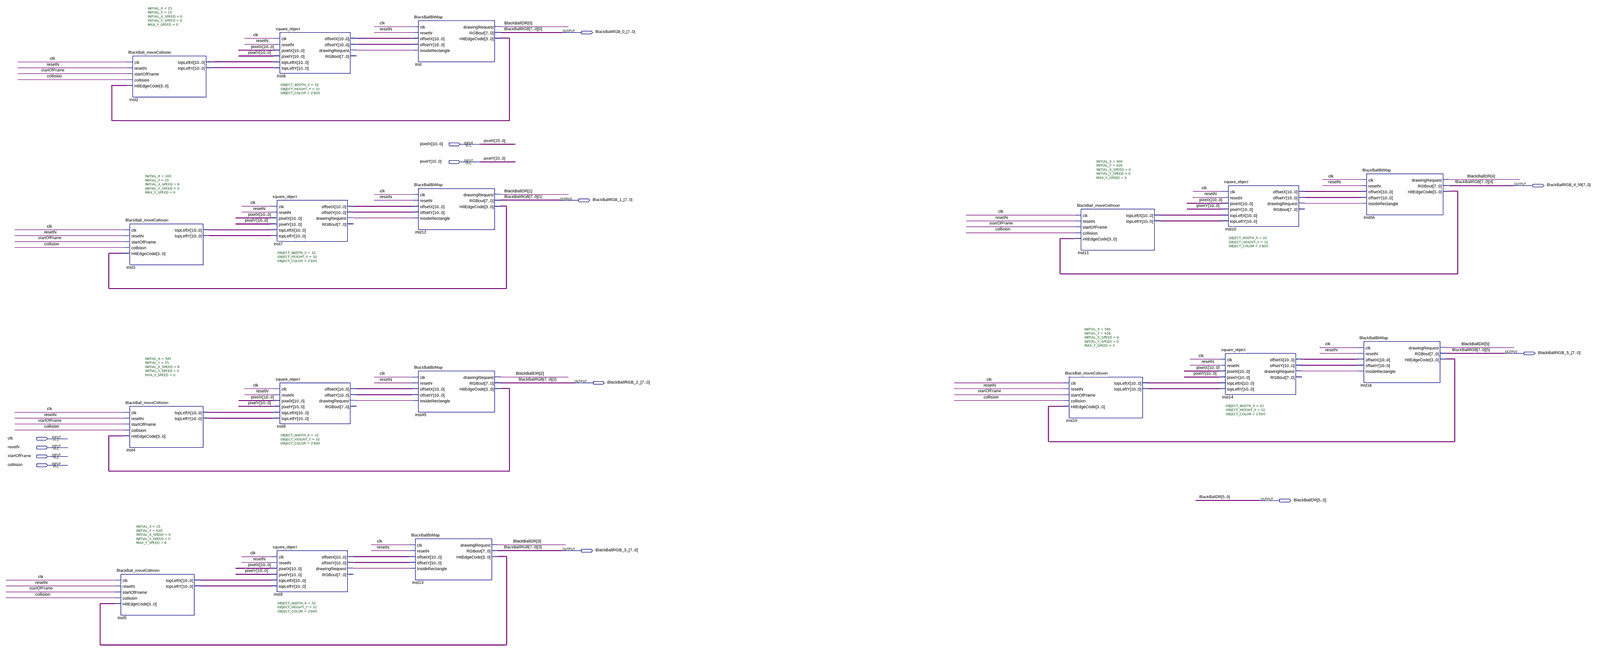
[diagram p0: schematic sheet, whole]
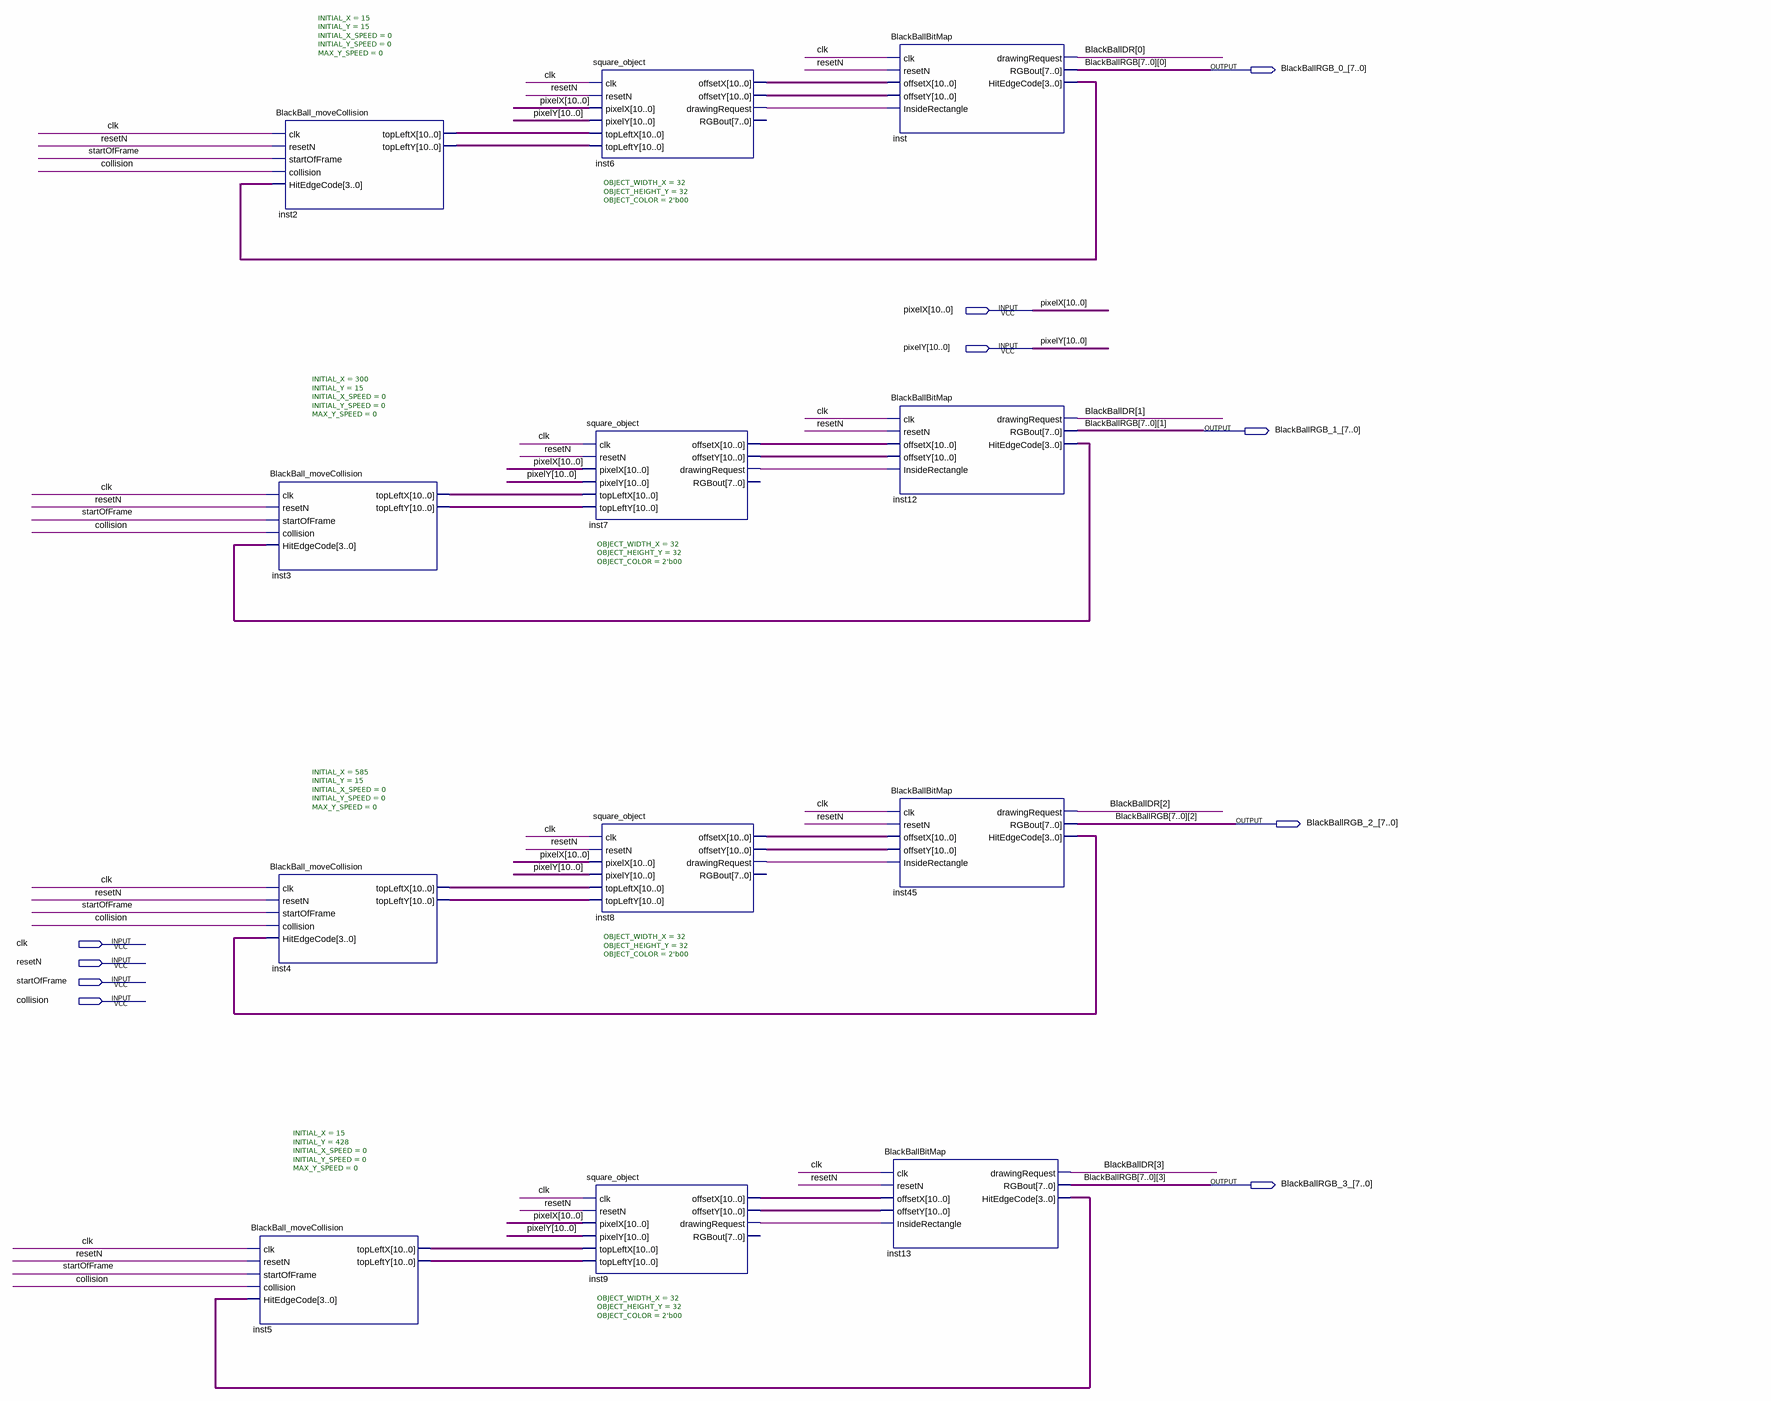
[diagram p1: schematic sheet, left part]
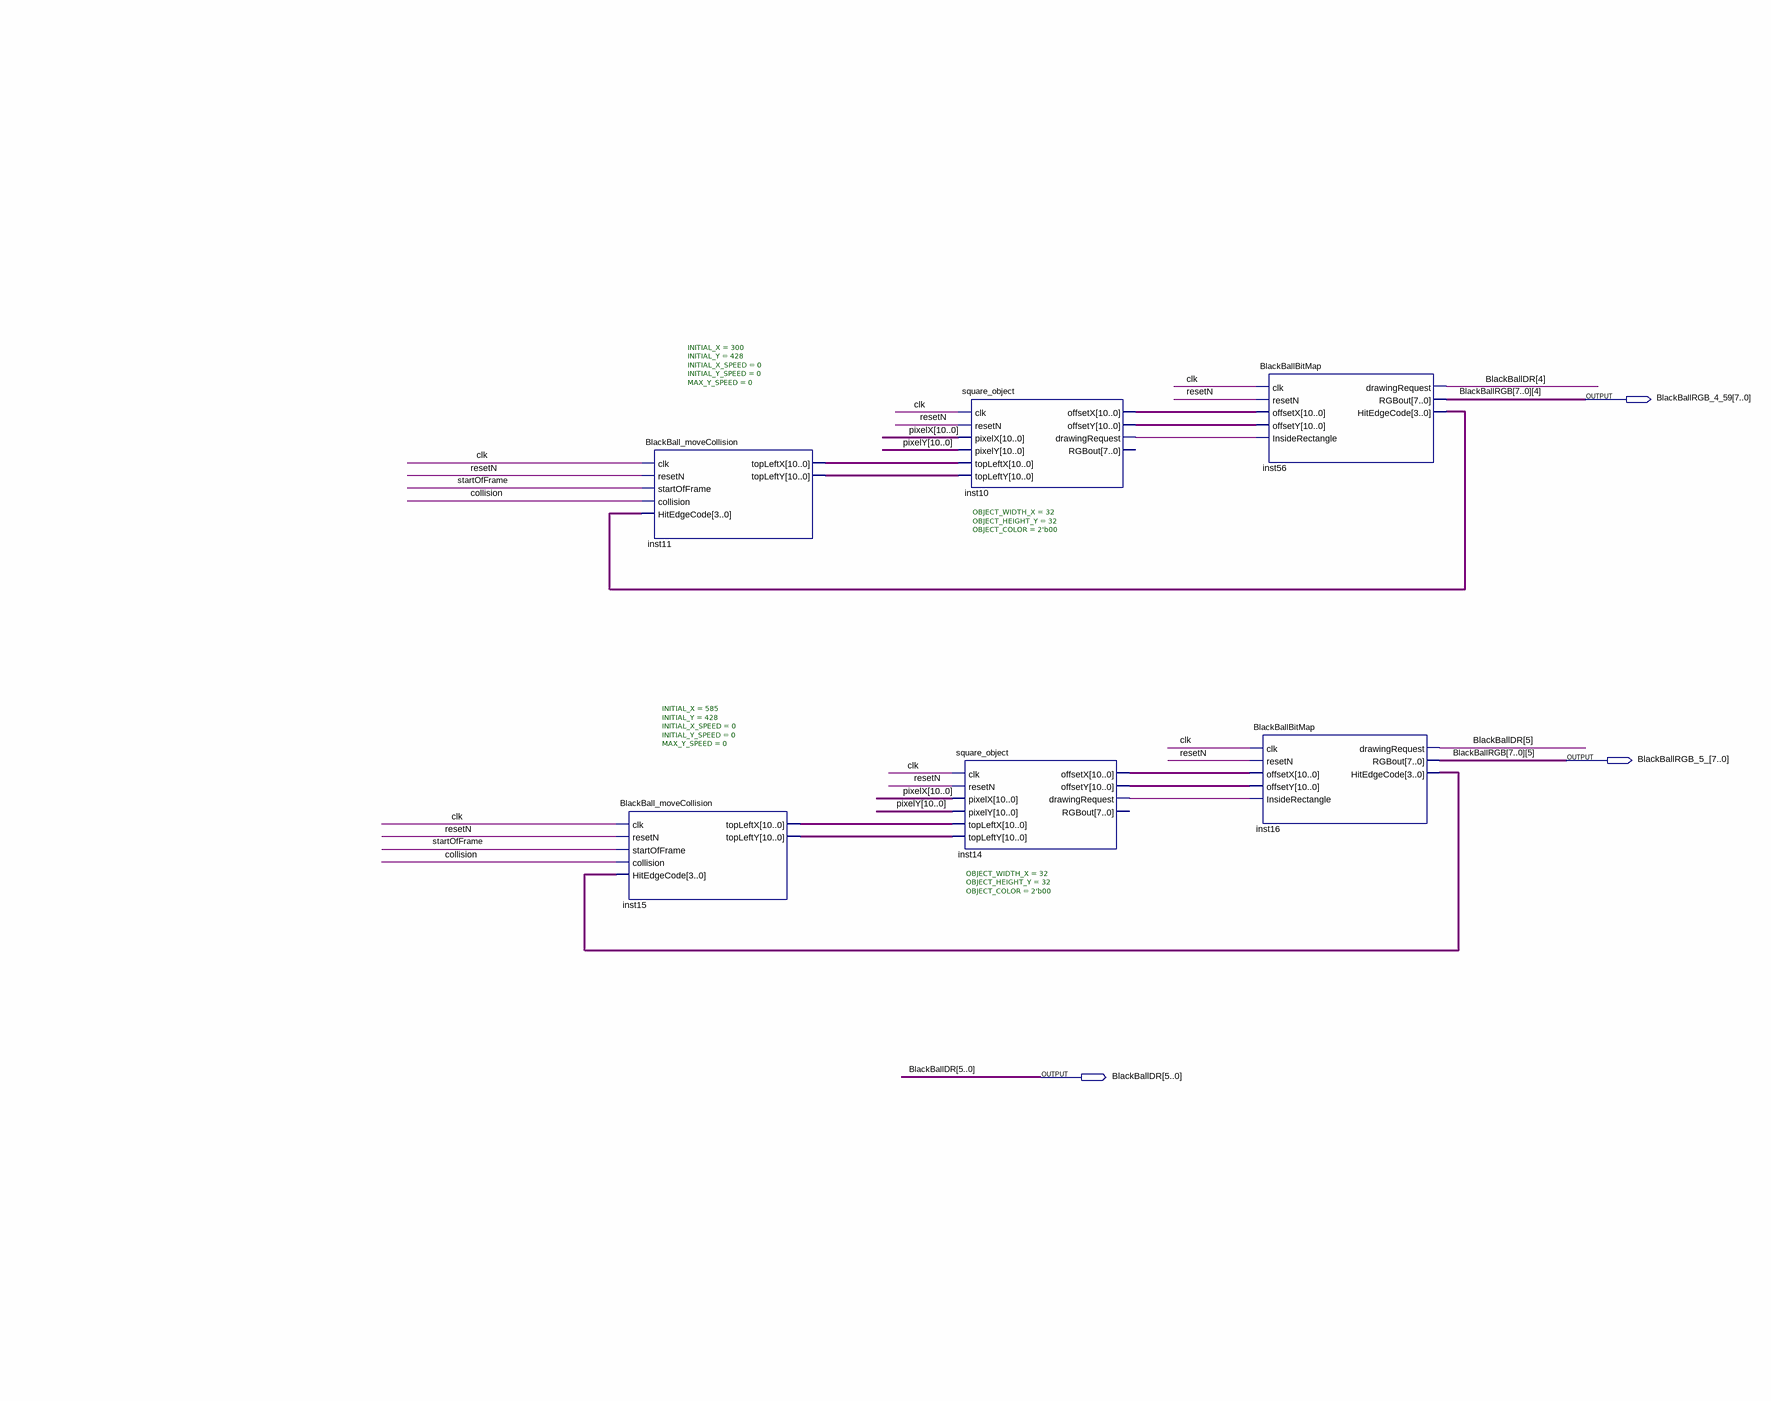
[diagram p2: schematic sheet, right part]
// Quartus schematic BlackBall_Block.bdf as structural Verilog: 18 symbols, 13 pins
module BlackBall_Block (
  input  [10:0] pixelX,
  input  [10:0] pixelY,
  input  clk,
  input  resetN,
  input  startOfFrame,
  input  collision,
  output [7:0] BlackBallRGB_0_,
  output [7:0] BlackBallRGB_4_59,
  output [7:0] BlackBallRGB_1_,
  output [7:0] BlackBallRGB_5_,
  output [7:0] BlackBallRGB_2_,
  output [5:0] BlackBallDR,
  output [7:0] BlackBallRGB_3_
);

  wire inst6_drawingrequest, inst7_drawingrequest, inst8_drawingrequest, inst9_drawingrequest,
       inst10_drawingrequest, inst14_drawingrequest;
  wire [3:0] inst12_hitedgecode, inst13_hitedgecode, inst16_hitedgecode, inst45_hitedgecode,
       inst56_hitedgecode, inst_hitedgecode;
  wire [10:0] inst2_topleftx, inst2_toplefty, inst3_topleftx, inst3_toplefty, inst4_topleftx, inst4_toplefty,
       inst5_topleftx, inst5_toplefty, inst6_offsetx, inst6_offsety, inst7_offsetx, inst7_offsety,
       inst8_offsetx, inst8_offsety, inst9_offsetx, inst9_offsety, inst10_offsetx, inst10_offsety,
       inst11_topleftx, inst11_toplefty, inst14_offsetx, inst14_offsety, inst15_topleftx, inst15_toplefty;

  BlackBall_moveCollision #(.INITIAL_X(15), .INITIAL_Y(15), .INITIAL_X_SPEED(0), .INITIAL_Y_SPEED(0), .MAX_Y_SPEED(0)) inst2 (
    .clk(clk), .resetN(resetN), .startOfFrame(startOfFrame), .collision(collision),
    .HitEdgeCode(inst_hitedgecode), .topLeftX(inst2_topleftx), .topLeftY(inst2_toplefty));
  BlackBall_moveCollision #(.INITIAL_X(300), .INITIAL_Y(15), .INITIAL_X_SPEED(0), .INITIAL_Y_SPEED(0), .MAX_Y_SPEED(0)) inst3 (
    .clk(clk), .resetN(resetN), .startOfFrame(startOfFrame), .collision(collision),
    .HitEdgeCode(inst12_hitedgecode), .topLeftX(inst3_topleftx), .topLeftY(inst3_toplefty));
  BlackBall_moveCollision #(.INITIAL_X(585), .INITIAL_Y(15), .INITIAL_X_SPEED(0), .INITIAL_Y_SPEED(0), .MAX_Y_SPEED(0)) inst4 (
    .clk(clk), .resetN(resetN), .startOfFrame(startOfFrame), .collision(collision),
    .HitEdgeCode(inst45_hitedgecode), .topLeftX(inst4_topleftx), .topLeftY(inst4_toplefty));
  BlackBall_moveCollision #(.INITIAL_X(15), .INITIAL_Y(428), .INITIAL_X_SPEED(0), .INITIAL_Y_SPEED(0), .MAX_Y_SPEED(0)) inst5 (
    .clk(clk), .resetN(resetN), .startOfFrame(startOfFrame), .collision(collision),
    .HitEdgeCode(inst13_hitedgecode), .topLeftX(inst5_topleftx), .topLeftY(inst5_toplefty));
  square_object #(.OBJECT_WIDTH_X(32), .OBJECT_HEIGHT_Y(32), .OBJECT_COLOR(2'b00)) inst6 (
    .clk(clk), .resetN(resetN), .pixelX(pixelX), .pixelY(pixelY), .topLeftX(inst2_topleftx),
    .topLeftY(inst2_toplefty), .offsetX(inst6_offsetx), .offsetY(inst6_offsety),
    .drawingRequest(inst6_drawingrequest));  // open: RGBout
  square_object #(.OBJECT_WIDTH_X(32), .OBJECT_HEIGHT_Y(32), .OBJECT_COLOR(2'b00)) inst7 (
    .clk(clk), .resetN(resetN), .pixelX(pixelX), .pixelY(pixelY), .topLeftX(inst3_topleftx),
    .topLeftY(inst3_toplefty), .offsetX(inst7_offsetx), .offsetY(inst7_offsety),
    .drawingRequest(inst7_drawingrequest));  // open: RGBout
  square_object #(.OBJECT_WIDTH_X(32), .OBJECT_HEIGHT_Y(32), .OBJECT_COLOR(2'b00)) inst8 (
    .clk(clk), .resetN(resetN), .pixelX(pixelX), .pixelY(pixelY), .topLeftX(inst4_topleftx),
    .topLeftY(inst4_toplefty), .offsetX(inst8_offsetx), .offsetY(inst8_offsety),
    .drawingRequest(inst8_drawingrequest));  // open: RGBout
  square_object #(.OBJECT_WIDTH_X(32), .OBJECT_HEIGHT_Y(32), .OBJECT_COLOR(2'b00)) inst9 (
    .clk(clk), .resetN(resetN), .pixelX(pixelX), .pixelY(pixelY), .topLeftX(inst5_topleftx),
    .topLeftY(inst5_toplefty), .offsetX(inst9_offsetx), .offsetY(inst9_offsety),
    .drawingRequest(inst9_drawingrequest));  // open: RGBout
  BlackBallBitMap inst13 (
    .clk(clk), .resetN(resetN), .offsetX(inst9_offsetx), .offsetY(inst9_offsety),
    .InsideRectangle(inst9_drawingrequest), .drawingRequest(BlackBallDR[3]), .RGBout(BlackBallRGB_3_),
    .HitEdgeCode(inst13_hitedgecode));
  BlackBallBitMap inst (
    .clk(clk), .resetN(resetN), .offsetX(inst6_offsetx), .offsetY(inst6_offsety),
    .InsideRectangle(inst6_drawingrequest), .drawingRequest(BlackBallDR[0]), .RGBout(BlackBallRGB_0_),
    .HitEdgeCode(inst_hitedgecode));
  BlackBallBitMap inst12 (
    .clk(clk), .resetN(resetN), .offsetX(inst7_offsetx), .offsetY(inst7_offsety),
    .InsideRectangle(inst7_drawingrequest), .drawingRequest(BlackBallDR[1]), .RGBout(BlackBallRGB_1_),
    .HitEdgeCode(inst12_hitedgecode));
  BlackBallBitMap inst45 (
    .clk(clk), .resetN(resetN), .offsetX(inst8_offsetx), .offsetY(inst8_offsety),
    .InsideRectangle(inst8_drawingrequest), .drawingRequest(BlackBallDR[2]), .RGBout(BlackBallRGB_2_),
    .HitEdgeCode(inst45_hitedgecode));
  BlackBall_moveCollision #(.INITIAL_X(585), .INITIAL_Y(428), .INITIAL_X_SPEED(0), .INITIAL_Y_SPEED(0), .MAX_Y_SPEED(0)) inst15 (
    .clk(clk), .resetN(resetN), .startOfFrame(startOfFrame), .collision(collision),
    .HitEdgeCode(inst16_hitedgecode), .topLeftX(inst15_topleftx), .topLeftY(inst15_toplefty));
  BlackBall_moveCollision #(.INITIAL_X(300), .INITIAL_Y(428), .INITIAL_X_SPEED(0), .INITIAL_Y_SPEED(0), .MAX_Y_SPEED(0)) inst11 (
    .clk(clk), .resetN(resetN), .startOfFrame(startOfFrame), .collision(collision),
    .HitEdgeCode(inst56_hitedgecode), .topLeftX(inst11_topleftx), .topLeftY(inst11_toplefty));
  square_object #(.OBJECT_WIDTH_X(32), .OBJECT_HEIGHT_Y(32), .OBJECT_COLOR(2'b00)) inst10 (
    .clk(clk), .resetN(resetN), .pixelX(pixelX), .pixelY(pixelY), .topLeftX(inst11_topleftx),
    .topLeftY(inst11_toplefty), .offsetX(inst10_offsetx), .offsetY(inst10_offsety),
    .drawingRequest(inst10_drawingrequest));  // open: RGBout
  square_object #(.OBJECT_WIDTH_X(32), .OBJECT_HEIGHT_Y(32), .OBJECT_COLOR(2'b00)) inst14 (
    .clk(clk), .resetN(resetN), .pixelX(pixelX), .pixelY(pixelY), .topLeftX(inst15_topleftx),
    .topLeftY(inst15_toplefty), .offsetX(inst14_offsetx), .offsetY(inst14_offsety),
    .drawingRequest(inst14_drawingrequest));  // open: RGBout
  BlackBallBitMap inst56 (
    .clk(clk), .resetN(resetN), .offsetX(inst10_offsetx), .offsetY(inst10_offsety),
    .InsideRectangle(inst10_drawingrequest), .drawingRequest(BlackBallDR[4]), .RGBout(BlackBallRGB_4_59),
    .HitEdgeCode(inst56_hitedgecode));
  BlackBallBitMap inst16 (
    .clk(clk), .resetN(resetN), .offsetX(inst14_offsetx), .offsetY(inst14_offsety),
    .InsideRectangle(inst14_drawingrequest), .drawingRequest(BlackBallDR[5]), .RGBout(BlackBallRGB_5_),
    .HitEdgeCode(inst16_hitedgecode));

  // Other names for the same wires on the sheet: BlackBallRGB_0[5:0] = {BlackBallRGB_5_[0], BlackBallRGB_4_59[0], BlackBallRGB_3_[0], BlackBallRGB_2_[0], BlackBallRGB_1_[0], BlackBallRGB_0_[0]};
  //   BlackBallRGB_1[5:0] = {BlackBallRGB_5_[1], BlackBallRGB_4_59[1], BlackBallRGB_3_[1], BlackBallRGB_2_[1], BlackBallRGB_1_[1], BlackBallRGB_0_[1]};
  //   BlackBallRGB_2[5:0] = {BlackBallRGB_5_[2], BlackBallRGB_4_59[2], BlackBallRGB_3_[2], BlackBallRGB_2_[2], BlackBallRGB_1_[2], BlackBallRGB_0_[2]};
  //   BlackBallRGB_3[5:0] = {BlackBallRGB_5_[3], BlackBallRGB_4_59[3], BlackBallRGB_3_[3], BlackBallRGB_2_[3], BlackBallRGB_1_[3], BlackBallRGB_0_[3]};
  //   BlackBallRGB_4[5:0] = {BlackBallRGB_5_[4], BlackBallRGB_4_59[4], BlackBallRGB_3_[4], BlackBallRGB_2_[4], BlackBallRGB_1_[4], BlackBallRGB_0_[4]};
  //   BlackBallRGB_5[5:0] = {BlackBallRGB_5_[5], BlackBallRGB_4_59[5], BlackBallRGB_3_[5], BlackBallRGB_2_[5], BlackBallRGB_1_[5], BlackBallRGB_0_[5]};
  //   BlackBallRGB_6[5:0] = {BlackBallRGB_5_[6], BlackBallRGB_4_59[6], BlackBallRGB_3_[6], BlackBallRGB_2_[6], BlackBallRGB_1_[6], BlackBallRGB_0_[6]};
  //   BlackBallRGB_7[5:0] = {BlackBallRGB_5_[7], BlackBallRGB_4_59[7], BlackBallRGB_3_[7], BlackBallRGB_2_[7], BlackBallRGB_1_[7], BlackBallRGB_0_[7]}
endmodule
